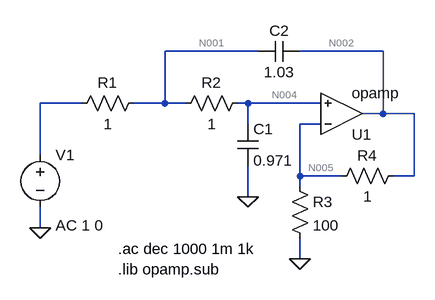
[diagram p0: schematic Draft1.asc]
Draft1.asc, the LTspice schematic file:
Version 4.1
SHEET 1 880 680
WIRE 272 -16 128 -16
WIRE 464 -16 336 -16
WIRE 0 64 -64 64
WIRE 128 64 128 -16
WIRE 128 64 80 64
WIRE 160 64 128 64
WIRE 256 64 240 64
WIRE 368 64 256 64
WIRE 464 80 464 -16
WIRE 464 80 432 80
WIRE 512 80 464 80
WIRE 256 96 256 64
WIRE 368 96 336 96
WIRE -64 144 -64 64
WIRE 336 176 336 96
WIRE 400 176 336 176
WIRE 512 176 512 80
WIRE 512 176 480 176
WIRE 336 192 336 176
WIRE 256 208 256 160
WIRE -64 256 -64 224
WIRE 336 304 336 272
FLAG -64 256 0
FLAG 256 208 0
FLAG 336 304 0
SYMBOL voltage -64 128 R0
WINDOW 123 24 124 Left 2
WINDOW 39 0 0 Left 0
SYMATTR InstName V1
SYMATTR Value ""
SYMATTR Value2 AC 1 0
SYMBOL res 96 48 R90
WINDOW 0 0 56 VBottom 2
WINDOW 3 32 56 VTop 2
SYMATTR InstName R1
SYMATTR Value 1
SYMBOL res 256 48 R90
WINDOW 0 0 56 VBottom 2
WINDOW 3 32 56 VTop 2
SYMATTR InstName R2
SYMATTR Value 1
SYMBOL res 320 176 R0
SYMATTR InstName R3
SYMATTR Value 100
SYMBOL res 496 160 R90
WINDOW 0 0 56 VBottom 2
WINDOW 3 32 56 VTop 2
SYMATTR InstName R4
SYMATTR Value 1
SYMBOL OpAmps\\opamp 400 144 M180
SYMATTR InstName U1
SYMBOL cap 240 96 R0
SYMATTR InstName C1
SYMATTR Value 0.971
SYMBOL cap 336 -32 R90
WINDOW 0 0 32 VBottom 2
WINDOW 3 32 32 VTop 2
SYMATTR InstName C2
SYMATTR Value 1.03
TEXT 56 288 Left 2 !.ac dec 1000 1m 1k
TEXT 56 320 Left 2 !.lib opamp.sub

The netlist it stands for:
* Draft1.asc
V1 N003 0 AC 1 0
R1 N001 N003 1
R2 N004 N001 1
R3 N005 0 100
R4 N002 N005 1
X§U1 N005 N004 N002 opamp Aol=100K GBW=10Meg  ; pins invin noninvin out
C1 N004 0 0.971
C2 N002 N001 1.03
.ac dec 1000 1m 1k
.lib opamp.sub
.backanno
.end

* Results of the author's LTspice run, read from the files saved beside the schematic
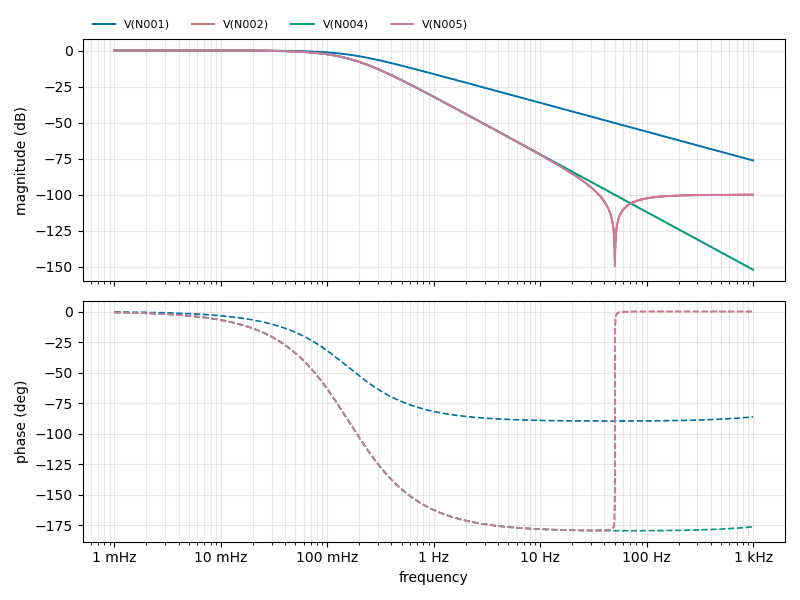
[diagram p1: AC Analysis of Draft1.asc, plotted from the saved traces]
* AC Analysis, 1 run:
*   V(N001): -0.00 dB at 1 mHz, -76.20 dB at 1 kHz, peak -0.00 dB at 1 mHz, 3 dB below the peak at 165.4 mHz
*   V(N002): 0.09 dB at 1 mHz, -99.94 dB at 1 kHz, peak 0.09 dB at 1 mHz, 3 dB below the peak at 107.6 mHz
*   V(N004): -0.00 dB at 1 mHz, -151.91 dB at 1 kHz, peak -0.00 dB at 1 mHz, 3 dB below the peak at 107.6 mHz
*   V(N005): -0.00 dB at 1 mHz, -100.02 dB at 1 kHz, peak -0.00 dB at 1 mHz, 3 dB below the peak at 107.6 mHz